# EAGLE design leoTracker_Boost (EAGLE 6.5.0)
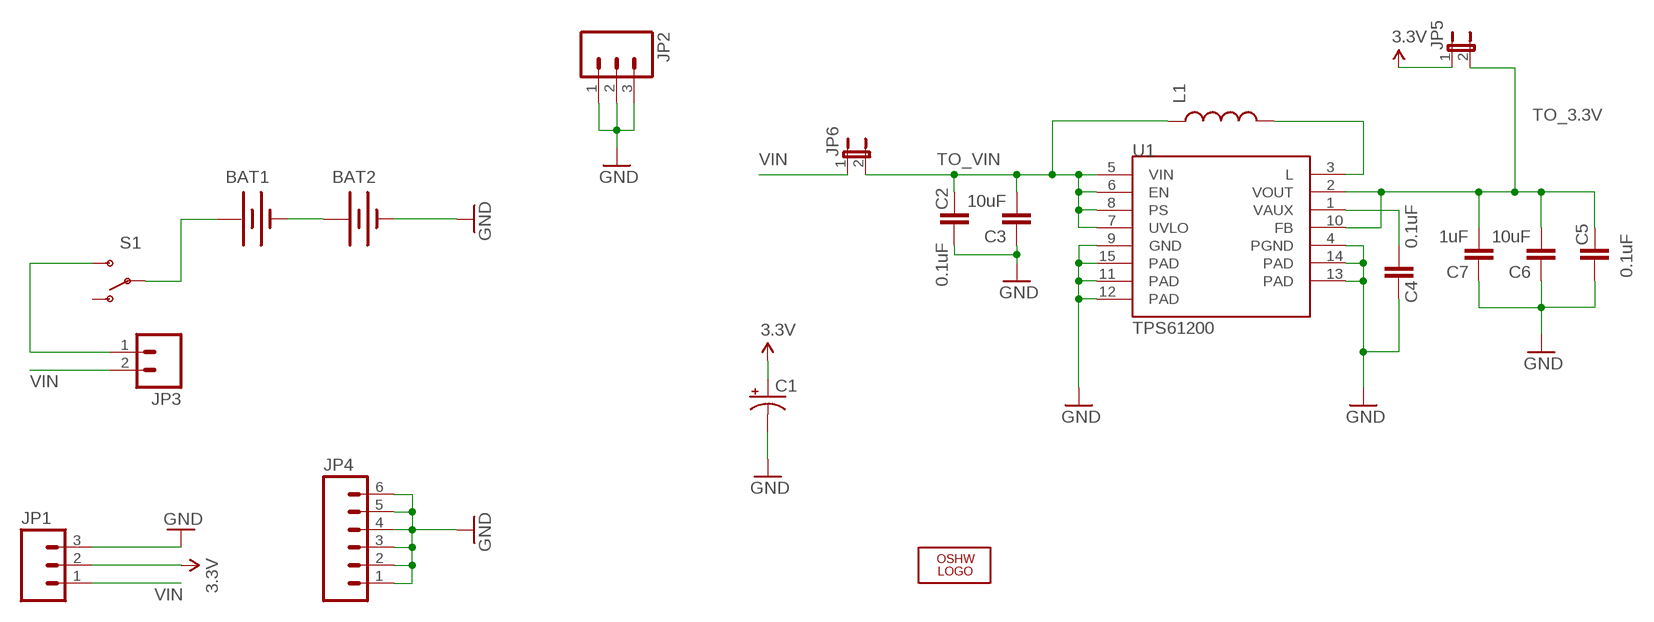
[diagram p0: schematic, sheet 1]

## Parts
BAT1  BATTERYAA  [BATTERY-AA]
BAT2  BATTERYAA  [BATTERY-AA]
C1  CAP_POL1206  [EIA3216]
C2  0.1uF  CAP0805  [0805]
C3  10uF  CAP0805  [0805]
C4  0.1uF  CAP0805  [0805]
C5  0.1uF  CAP0805  [0805]
C6  10uF  CAP0805  [0805]
C7  1uF  CAP0805  [0805]
JP1  M03LOCK  [1X03_LOCK]
JP2  M03LOCK  [1X03_LOCK]
JP3  M02LOCK  [1X02_LOCK]
JP4  M06LOCK  [1X06_LOCK]
JP5  JUMPER-2SMD-NC  [SJ_2S]
JP6  JUMPER-2SMD-NC  [SJ_2S]
L1  INDUCTOR.  [CDRH2D09]
LOGO2  OSHW_LOGO_6MILX0100-NT  [OSHW_6X100_NOTEXT]
S1  SWITCH-SPDTPTH  [SWITCH-SPDT]
U1  TPS61200  [QFN-10_PAD]

## Nets
3.3V: C1.A(+) JP1.2 JP5.1
GND [vcc]: BAT2.GND@1(-) C1.C(-) C2.2 C3.1 C4.1 C5.2 C6.1 C7.1 JP1.3 JP2.1 JP2.2 JP2.3 JP4.1 JP4.2 JP4.3 JP4.4 JP4.5 JP4.6 U1.4(PGND) U1.9(GND) U1.11(PAD) U1.12(PAD) U1.13(PAD) U1.14(PAD) U1.15(PAD)
N$1: L1.P$2 U1.3(L)
N$2: JP3.1 S1.3(S)
N$3: BAT1.GND@1(-) BAT2.PWR@1(+)
N$4: BAT1.PWR@1(+) S1.2(P)
N$5: C4.2 U1.1(VAUX)
TO_3.3V: C5.1 C6.2 C7.2 JP5.2 U1.2(VOUT) U1.10(FB)
TO_VIN: C2.1 C3.2 JP6.2 L1.P$1 U1.5(VIN) U1.6(EN) U1.7(UVLO) U1.8(PS)
VIN: JP1.1 JP3.2 JP6.1
Unconnected: S1.1(O)

## Library data of the parts
BAT1 BAT2 = SparkFunNewestAA:BATTERY: Battery Holders Various common sizes : AA, AAA, 20mm coin cell and 12mm coin cell.
C1 = SparkFun:CAP_POL: Capacitor Polarized These are standard SMD and PTH capacitors. Normally 10uF, 47uF, and 100uF in electrolytic and tantalum varieties. Always verify the external diameter of the through hole cap, it varies with capacity, voltage, and manufacturer. The EIA devices should be standard.
C2-C7 = SparkFun:CAP: Capacitor Standard 0603 ceramic capacitor, and 0.1" leaded capacitor.
JP1 JP2 = SparkFun:M03: Header 3 Standard 3-pin 0.1" header. Use with straight break away headers (SKU : PRT-00116), right angle break away headers (PRT-00553), swiss pins (PRT-00743), machine pins (PRT-00117), and female headers (PRT-00115). Molex polarized connector foot print use with SKU : PRT-08232 with associated crimp pins and housings.
JP3 = SparkFun:M02: Header 2 Standard 2-pin 0.1" header. Use with straight break away headers (SKU : PRT-00116), right angle break away headers (PRT-00553), swiss pins (PRT-00743), machine pins (PRT-00117), and female headers (PRT-00115). Molex polarized connector foot print use with SKU : PRT-08233 with associated crimp pins and housings.
JP4 = SparkFun:M06: Header 6 Standard 6-pin 0.1" header. Use with straight break away headers (SKU : PRT-00116), right angle break away headers (PRT-00553), swiss pins (PRT-00743), machine pins (PRT-00117), and female headers (PRT-00115). Molex polarized connector foot print use with SKU : PRT-08094 with associated crimp pins and housings. NOTES ON THE VARIANTS LOCK and LOCK_LONGPADS... This footprint was designed to help hold the alignment of a through-hole component (i.e. 6-pin header) while soldering it into place. You may notice that each hole has been shifted either up or down by 0.005 of an inch from it's more standard position (which is a perfectly straight line). This slight alteration caused the pins (the squares in the middle) to touch the edges of the holes. Because they are alternating, it causes a "brace" to hold the component in place. 0.005 has proven to be the perfect amount of "off-center" position when using our standard breakaway headers. Although looks a little odd when you look at the bare footprint, once you have a header in there, the alteration is very hard to notice. Also, if you push a header all the way into place, it is covered up entirely on the bottom side. This idea of altering the position of holes to aid alignment will be further integrated into the Sparkfun Library for other footprints. It can help hold any component with 3 or more connection pins.
JP5 JP6 = SparkFun:JUMPER-2: Jumper Basic 0.1" spaced jumper. Use with breakaway headers.
L1 = SparkFun-Passives:INDUCTOR: Inductors Basic Inductor/Choke - 0603 and 1206. Footprints are not proven and vary greatly between part numbers.
LOGO2 = ohw-logo:OSHW_LOGO_6MIL
S1 = SparkFun-Electromechanical:SWITCH-SPDT: SPST Switch Simple slide switch. Spark Fun Electronics SKU : COM-00102
U1 = SparkFun-PowerIC:TPS61200: DC to DC Booster

## Net classes
0 ten10: width 0.254 mm
1 vcc: width 0.254 mm
2 20: width 0.508 mm

## Board
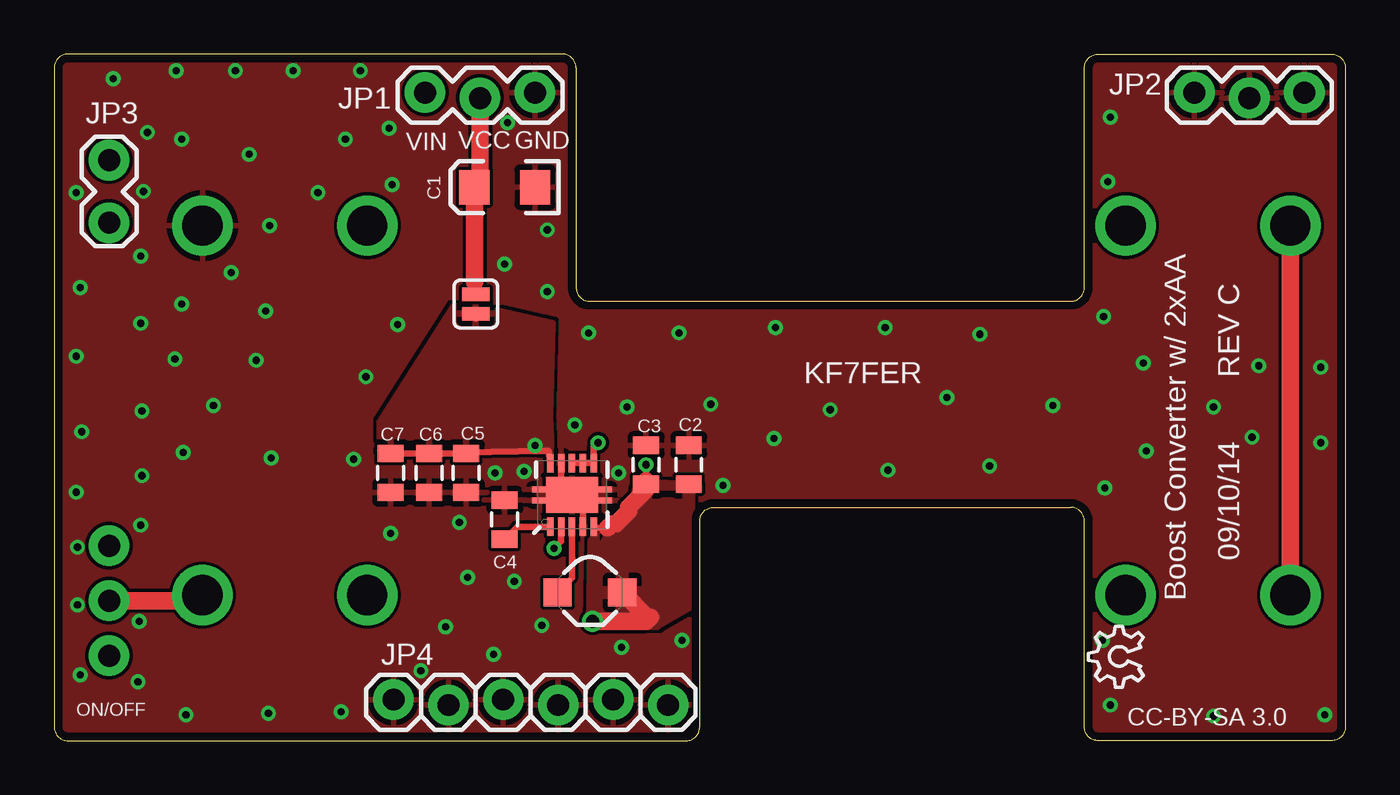
[diagram p1: board, top side]
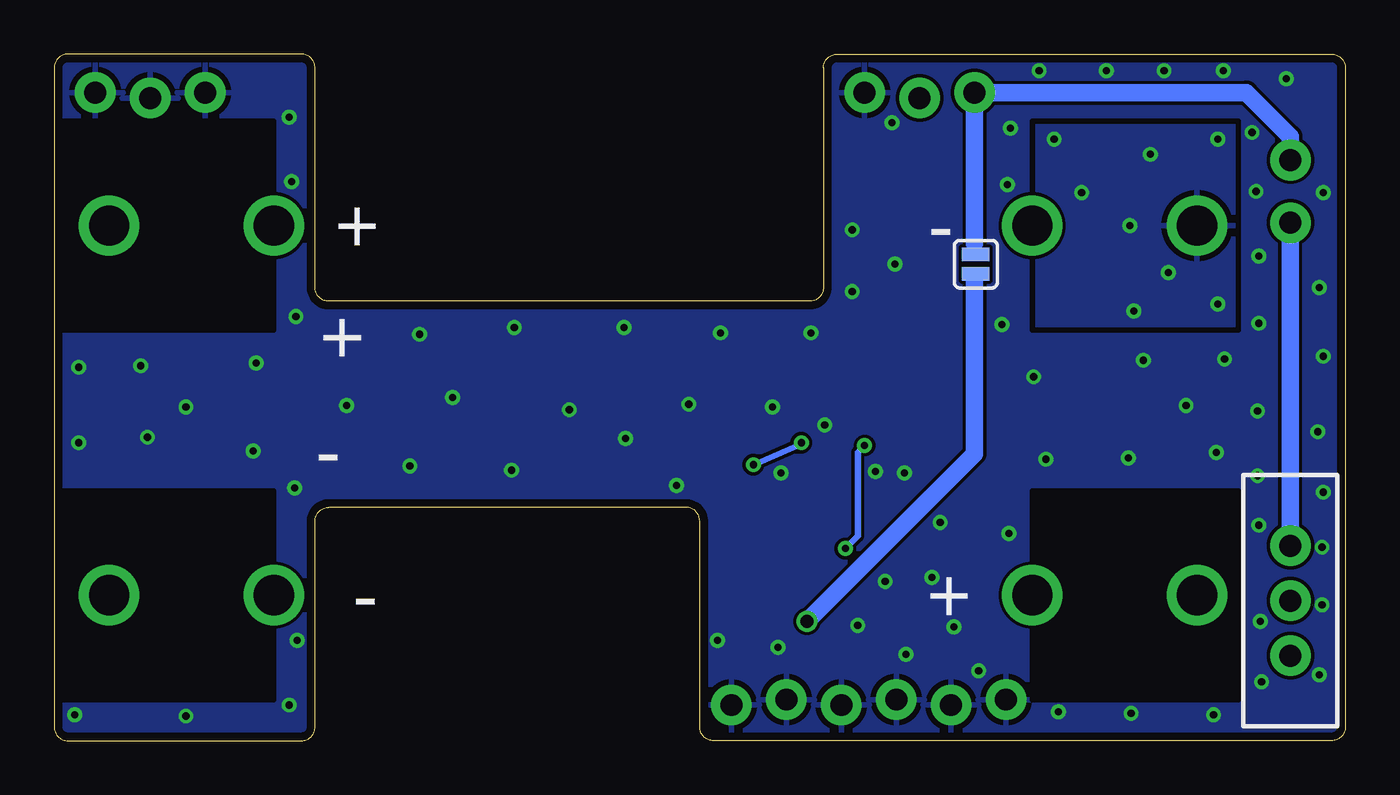
[diagram p2: board, bottom side, seen from below]

Size 59.69 x 31.75 mm. Coordinates in mm from the lower left corner, seen from the top.
Outline: 0,31.11 0,0.64 arc90 0.64,0 29.21,0 arc90 29.84,0.64 29.84,10.16 arc-90 30.48,10.79 46.99,10.79 arc-90 47.62,10.16 47.62,0.64 arc90 48.26,0 59.05,0 arc90 59.69,0.64 59.69,31.11 arc90 59.05,31.75 48.26,31.75 arc90 47.62,31.11 47.62,20.95 arc-90 46.99,20.32 24.77,20.32 arc-90 24.13,20.95 24.13,31.11 arc90 23.5,31.75 0.64,31.75 arc90 0,31.11
Copper layers (1*16): Top 0.0356mm / dielectric 1.5011mm / Bottom 0.0356mm
Design rules "LaenPCBOrder *": minimum track width 6mil, minimum drill 13mil, track to track 6mil, track to pad 6mil, pad to pad 6mil, via to via 6mil, smd to smd 6mil, copper to edge 15mil, drill to drill 6mil, minimum pad ring 7mil, minimum via ring 7mil, stop-mask expansion 3mil, vias tented up to drill 25mil, thermal gap 10mil

### Footprints (pad centres in the part's own frame; a part is rotated, then mirrored left to right if it is on the bottom)
BATTERY-AA = drill 1.854: GND@1 25.146,0; GND@2 17.526,0; PWR@1 -25.146,0; PWR@2 -17.526,0
EIA3216 = smd 1.4 x 1.6: A 1.4,0; C -1.4,0
0805 = smd 0.8 x 1.2: 1 -0.9,0; 2 0.9,0
1X03_LOCK = drill 1.016 pad 1.88: 1 0,0.127; 2 2.54,-0.127; 3 5.08,0.127
1X02_LOCK = drill 1.016 pad 1.88: 1 -0.178,0; 2 2.718,0
1X06_LOCK = drill 1.016 pad 1.88: 1 0,0; 2 2.54,-0.254; 3 5.08,0; 4 7.62,-0.254; 5 10.16,0; 6 12.7,-0.254
SJ_2S = smd 0.635 x 1.27: 1 -0.45,0; 2 0.45,0
CDRH2D09 = smd 1.3 x 1.3: P$1 -1.5,0; P$2 1.5,0
SWITCH-SPDT = drill 1.016 pad 1.88: 1 0,2.54; 2 0,0; 3 0,-2.54
QFN-10_PAD = smd 0.297 x 0.85: 1 -1,-1.475; 2 -0.5,-1.475; 3 0,-1.475; 4 0.5,-1.475; 5 1,-1.475; 6 1,1.475; 7 0.5,1.475; 8 0,1.475; 9 -0.5,1.475; 10 -1,1.475 | smd 0.7 x 0.28: 11 -1.5,0.25; 12 -1.5,-0.25; 13 1.5,0.25; 14 1.5,-0.25 | smd 2.4 x 1.65: 15 0,0

### Placement (x,y rotation side)
BAT1  32,6.73 180 bottom
BAT2  32,23.83 0 bottom
C1  20.83,25.59 180 top
C2  29.34,12.76 90 top
C3  27.37,12.76 270 top
C4  20.83,10.22 270 top
C5  19.05,12.38 270 top
C6  17.34,12.38 90 top
C7  15.56,12.38 90 top
JP1  17.14,29.84 0 top
JP2  52.7,29.84 0 top
JP3  2.54,24.13 90 top
JP4  15.68,1.91 0 top
JP5  19.49,20.19 270 top
JP6  17.08,22.03 270 bottom
L1  24.77,6.86 180 top
LOGO2  50.36,2.48 90 top
S1  2.54,6.48 180 bottom
U1  23.94,11.37 0 top

### Tracks (layer width: path | path; a pad name or v marks a point on that pad's centre or on a via)
3.3V
  Top 0.508: 19.43,21.21 19.43,20.71 JP5.1
  Top 0.813: JP1.2 19.68,25.85 C1.A 19.43,21.28 19.43,21.21
GND  (via drill 0.33)
  Top 0.305: U1.12 23.69,11.12 U1.15 | U1.14 24.38,11.12 | 24.38,11.12 24.19,11.12 U1.15 | U1.9 23.44,11.87 U1.15 | U1.4 24.44,11.06 24.38,11.12
  other vias: 22.8,23.62 15.62,25.72 15.49,28.32 2.73,30.61 4.32,28.13 4,19.3 1.21,20.95 1.27,14.29 4.06,15.24 10.03,13.08 5.59,17.65 9.33,17.59 6.1,1.21 13.27,1.33 3.87,2.73 1.02,11.49 1.08,8.95 1.08,6.29 1.21,3.05 26.23,4.32 48.58,11.68 55.37,14.03 58.55,13.78 58.55,17.27 55.69,17.34 50.36,17.46 48.51,19.62 48.83,28.83 38.42,19.11 43.24,12.7 7.37,15.49 11.05,30.99 5.65,30.99 5.97,13.34 18.1,5.27 16.95,3.24 50.48,13.4 42.8,18.8 1.02,17.78 48.83,1.65 58.74,1.21 48.45,4.64 9.91,1.27 38.54,12.51 46.16,15.49 48.7,25.84 26.1,12.38 41.27,15.88 4,9.97 4.06,12.26 3.94,5.52 53.59,1.14 1.02,25.34 14.16,30.99 8.38,30.99 29.02,4.64 53.59,15.43 20.95,28.57 4.13,25.4 4,22.42 13.46,27.81 5.91,27.81 12.19,25.34 8.19,21.65 9.78,19.88 5.91,20.19 9.02,27.11 9.97,23.81 35.88,15.3 30.92,11.81 33.34,19.11 30.35,15.56 26.48,15.43 24.07,14.61 24.7,18.86 22.8,20.76 28.89,18.86 22.54,5.33 21.27,7.37 18.73,10.1 15.56,9.59 19.11,7.56 20.32,4 13.84,13.02 14.41,16.83 15.88,19.24 20.83,22.03 21.72,12.45 20.38,12.38 33.27,13.97
  pour Top (rank 2): 0,31.75 59.69,31.75 59.69,0 0,0
  pour Bottom (rank 2): 0,31.75 59.69,31.75 59.69,0 0,0
N$1
  Top 0.305: U1.3 23.94,7.53 L1.P$2
N$2
  Bottom 0.813: S1.3 JP3.1
N$3
  Top 0.813: BAT2.PWR@1 BAT1.GND@1
N$4
  Top 0.813: 2.6,6.41 S1.2 5.33,6.48 5.91,6.41 BAT1.PWR@1
N$5
  Top 0.305: U1.1 21.4,9.89 C4.2
TO_3.3V  (via drill 0.33)
  Top 0.305: U1.10 22.92,12.9 22.86,13.4 22.67,13.39 | 22.67,13.39 18.99,13.34 C5.1 C6.2 C7.2 | U1.2 23.44,9.22 v23.11,8.89 | v22.23,13.65 22.42,13.4 22.67,13.39
  Top 0.508: JP5.2 19.49,19.62
  Bottom 0.305: v23.11,8.89 22.54,9.46 22.54,13.34 v22.23,13.65
  pour Top: 18.61,20.32 23.05,19.3 22.92,14.99 22.99,13.4 15.05,13.46 15.05,14.73
TO_VIN  (via drill 0.33, 0.6)
  Top 0.305: U1.8 U1.7 U1.6 24.94,13.57 v25.15,13.78 | v27.37,12.76 27.37,12 27.29,11.94 C3.2 | 25.59,9.84 24.99,9.84 U1.5
  Top 0.813: v24.89,5.52 27.37,5.52 27.56,5.71 27.41,5.71 L1.P$1 | 27.37,12 27.37,11.62 26.54,10.79 26.54,10.6 25.97,10.03 25.78,10.03 25.59,9.84
  Bottom 0.305: v25.15,13.78 25.15,13.72 v27.37,12.76
  Bottom 0.508: JP6.2 17.14,21.4
  Bottom 0.813: 17.14,21.4 17.14,13.27 v24.89,5.52
  pour Top: 27.11,11.81 29.65,11.75 29.34,6.29 27.81,5.4 24.89,5.4 24.96,9.21 26.42,10.1
VIN
  Bottom 0.508: 17.14,22.99 17.14,22.55 JP6.1
  Bottom 0.813: JP3.2 2.54,27.94 4.57,29.97 JP1.1 17.14,22.99

### Text on the board
tPlace: VIN | VCC | GND | REV C | KF7FER | 09/10/14 | Boost Converter w/ 2xAA | ON/OFF | CC-BY-SA 3.0
bPlace: + | -